# Altium project RX5808_TOP.PrjPcb
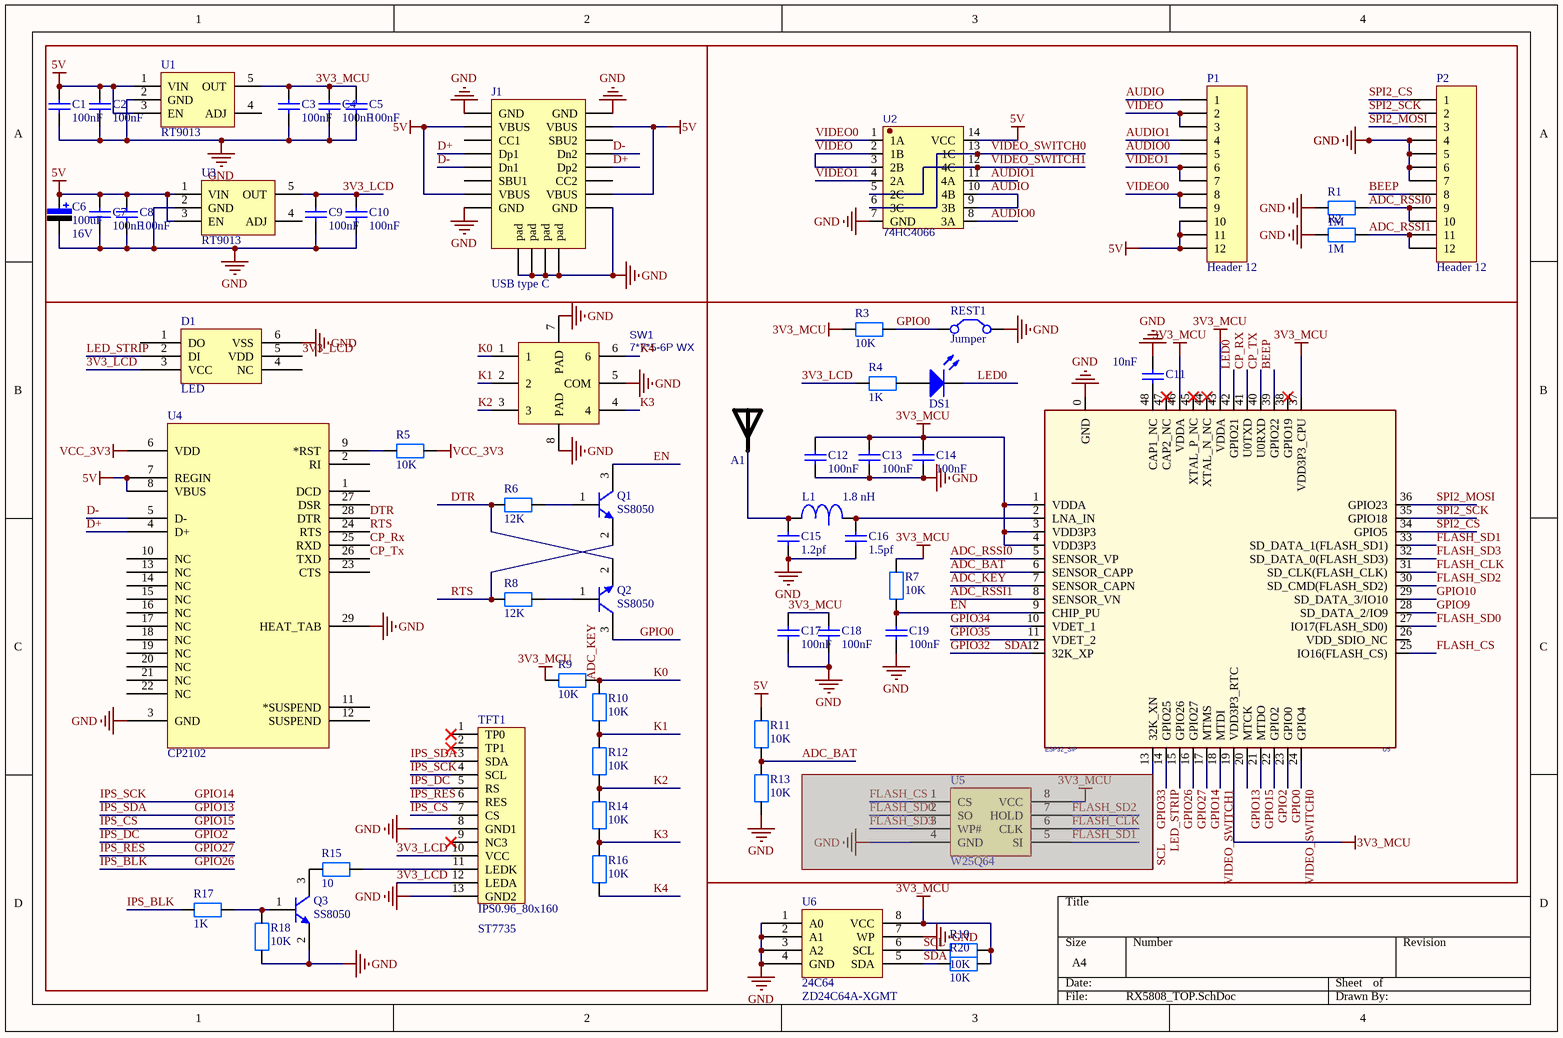
[diagram p0: RX5808_TOP.SchDoc]
1 sheet, 59 parts. Net scope: global (net labels, ports and power ports of the same name join across sheets).
Board file: RX5808_TOP.PcbDoc

## Sheet RX5808_TOP.SchDoc
size A4; SheetNumber: 1; SheetTotal: 1

### Parts
(Parts that share a designator on the sheet are numbered #1, #2 ... from top to bottom, then left to right.)
A1  RAINSUN  [ANT-Rainsun-AN5120]  (value not drawn)
C1  value 100nF  [0603_CAP]  (hidden comment: Cap)
C2  value 100nF  [0603_CAP]  (hidden comment: Cap)
C3  value 100nF  [0603_CAP]  (hidden comment: Cap)
C4  value 100nF  [0603_CAP]  (hidden comment: Cap)
C5  value 100nF  [0603_CAP]  (hidden comment: Cap)
C6  value 100uF  Vol: 16V  [CAP-3216]  (hidden comment: Cap Pol)
C7  value 100nF  [0603_CAP]  (hidden comment: Cap)
C8  value 100nF  [0603_CAP]  (hidden comment: Cap)
C9  value 100nF  [0603_CAP]  (hidden comment: Cap)
C10  value 100nF  [0603_CAP]  (hidden comment: Cap)
C11  value 10nF  [0603_CAP]  (hidden comment: Cap)
C12  value 100nF  [0603_CAP]  (hidden comment: Cap)
C13  value 100nF  [0603_CAP]  (hidden comment: Cap)
C14  value 100nF  [0603_CAP]  (hidden comment: Cap)
C15  value 1.2pf  [0603_CAP]  (hidden comment: Cap)
C16  value 1.5pf  [0603_CAP]  (hidden comment: Cap)
C17  value 100nF  [0603_CAP]  (hidden comment: Cap)
C18  value 100nF  [0603_CAP]  (hidden comment: Cap)
C19  value 100nF  [0603_CAP]  (hidden comment: Cap)
D1  LED  [LED-SMD_6P-L5.0-W5.0-TL]
DS1  LED  [0603_LED]  (value not drawn)
J1  USB type C  [USB Type-C-16Pin_A]
L1  1.8 nH  [L 0603]
P1  Header 12  [HDR1.27-1x12]
P2  Header 12  [HDR1.27-1x12]
Q1  SS8050  [SOT23A]
Q2  SS8050  [SOT23A]
Q3  SS8050  [SOT23A]
R1  1M  [0603_RES]
R2  1M  [0603_RES]
R3  10K  [0603_RES]
R4  1K  [0603_RES]
R5  10K  [0603_RES]
R6  12K  [0603_RES]
R7  10K  [0603_RES]
R8  12K  [0603_RES]
R9  10K  [0603_RES]
R10  10K  [0603_RES]
R11  10K  [0603_RES]
R12  10K  [0603_RES]
R13  10K  [0603_RES]
R14  10K  [0603_RES]
R15  10  [0603_RES]
R16  10K  [0603_RES]
R17  1K  [0603_RES]
R18  10K  [0603_RES]
R19  10K  [0603_RES]
R20  10K  [0603_RES]
REST1  Jumper  [SW-SMD_ST-1195]
SW1  7*7*5-6P WX  [SW-SMD_8P-L7.0-W7.0-P1.40-LS7.4-TL]
TFT1  IPS0.96_80x160  [IPS-0.96]
U1  RT9013  [SOT-23-5_L3.0-W1.7-P0.95-LS2.8-TL]
U2  74HC4066  [TSSOP-14_L5.0-W4.4-P0.65-LS6.4-BL]
U3  RT9013  [SOT-23-5_L3.0-W1.7-P0.95-LS2.8-TL]
U4  CP2102  [QFN-28]
U5#1  ESP32_SIP  [QFN-48_7X7]
U5#2  W25Q64  [SOP-8_width]  (masked out: inside a compile mask, not in the netlist)
U6  24C64  [TSSOP-8_L4.4-W3.0-P0.65-LS6.4-BL-2]

### Nets
3V3_MCU: C3.1 C4.2 C5.2 C12.1 C13.1 C14.1 C17.1 C18.1 R3.2 R7.2 R9.1 R19.1 R20.1 U1.5(OUT) U5#1.1(VDDA) U5#1.3(VDD3P3) U5#1.4(VDD3P3) U5#1.19(VDD3P3_RTC) U5#1.37(VDD3P3_CPU) U5#1.43(VDDA) U5#1.46(VDDA) U6.8(VCC)
5V: C1.2 C2.1 C6.1 C7.2 C8.1 J1.A4(VBUS) J1.A9(VBUS) J1.B4(VBUS) J1.B9(VBUS) P1.10 P1.11 P1.12 R11.2 U1.1(VIN) U1.3(EN) U2.14(VCC) U3.1(VIN) U3.3(EN) U4.7(REGIN) U4.8(VBUS)
GND: C1.1 C2.2 C3.2 C4.1 C5.1 C6.2 C7.1 C8.2 C9.2 C10.2 C11.1 C12.2 C13.2 C14.2 C15.2 C16.2 C17.2 C18.2 C19.2 D1.6(VSS) J1.1(pad) J1.A1(GND) J1.A12(GND) J1.B1(GND) J1.B12(GND) P2.4 P2.5 P2.6 P2.7 Q3.2(E) R1.2 R2.2 R13.1 R18.2 REST1.2(C2) SW1.5(COM) SW1.7(PAD) SW1.8(PAD) TFT1.8(GND1) TFT1.13(GND2) U1.2(GND) U2.7(GND) U3.2(GND) U4.3(GND) U4.29(HEAT_TAB) U5#1.0(GND) U6.1(A0) U6.2(A1) U6.3(A2) U6.4(GND) U6.7(WP)
VCC_3V3: R5.2 U4.6(VDD)
3V3_LCD: C9.1 C10.1 D1.3(VCC) D1.5(VDD) R4.2 TFT1.10(VCC) TFT1.12(LEDA) U3.5(OUT)
ADC_BAT: R11.1 R13.2 U5#1.6(SENSOR_CAPP)
ADC_KEY: R9.2 R10.2 SW1.1 U5#1.7(SENSOR_CAPN)  [also labelled K0]
ADC_RSSI0: P2.9 P2.10 R1.1 U5#1.5(SENSOR_VP)
ADC_RSSI1: P2.11 P2.12 R2.1 U5#1.8(SENSOR_VN)
AUDIO: P1.1 U2.9(3B) U2.10(4B)
AUDIO0: P1.5 U2.8(3A)
AUDIO1: P1.4 U2.11(4A)
BEEP: P2.8 U5#1.39(GPIO22)
CP_RX: U4.25(RXD) U5#1.41(U0TXD)
CP_TX: U4.26(TXD) U5#1.40(U0RXD)
D+: J1.A6(Dp1) J1.B6(Dp2) U4.4(D+)
D-: J1.A7(Dn1) J1.B7(Dn2) U4.5(D-)
DTR: Q2.2(E) R6.1 U4.28(DTR)
EN: C19.1 Q1.3(C) R7.1 U5#1.9(CHIP_PU)
FLASH_CLK: U5#1.31(SD_CLK(FLASH_CLK))
FLASH_CS: U5#1.25(IO16(FLASH_CS))
FLASH_SD0: U5#1.27(IO17(FLASH_SD0))
FLASH_SD1: U5#1.33(SD_DATA_1(FLASH_SD1))
FLASH_SD2: U5#1.30(SD_CMD(FLASH_SD2))
FLASH_SD3: U5#1.32(SD_DATA_0(FLASH_SD3))
GPIO0: Q2.3(C) R3.1 REST1.1(C1) U5#1.23(GPIO0)
GPIO2: TFT1.5(RS) U5#1.22(GPIO2)  [also labelled IPS_DC]
GPIO9: U5#1.28(SD_DATA_2/IO9)
GPIO10: U5#1.29(SD_DATA_3/IO10)
GPIO13: TFT1.3(SDA) U5#1.20(MTCK)  [also labelled IPS_SDA]
GPIO14: TFT1.4(SCL) U5#1.17(MTMS)  [also labelled IPS_SCK]
GPIO15: TFT1.7(CS) U5#1.21(MTDO)  [also labelled IPS_CS]
GPIO26: R17.1 U5#1.15(GPIO26)  [also labelled IPS_BLK]
GPIO27: TFT1.6(RES) U5#1.16(GPIO27)  [also labelled IPS_RES]
GPIO32: R20.2 U5#1.12(32K_XP) U6.5(SDA)  [also labelled SDA]
GPIO34: U5#1.10(VDET_1)
GPIO35: U5#1.11(VDET_2)
K1: R10.1 R12.2 SW1.2
K2: R12.1 R14.2 SW1.3
K3: R14.1 R16.2 SW1.4
K4: R16.1 SW1.6
LED0: DS1.2(K) U5#1.42(GPIO21)
LED_STRIP: D1.2(DI) U5#1.14(GPIO25)
RTS: Q1.2(E) R8.1 U4.24(RTS)
SCL: R19.2 U6.6(SCL)
SPI2_CS: P2.1 U5#1.34(GPIO5)
SPI2_MOSI: P2.3 U5#1.36(GPIO23)
SPI2_SCK: P2.2 U5#1.35(GPIO18)
VIDEO: P1.2 P1.3 U2.2(1B) U2.3(2B)
VIDEO0: P1.8 P1.9 U2.1(1A)
VIDEO1: P1.6 P1.7 U2.4(2A)
VIDEO_SWITCH0: U2.6(3C) U2.13(1C) U5#1.24(GPIO4)
VIDEO_SWITCH1: U2.5(2C) U2.12(4C) U5#1.18(MTDI)
NetA1_1: A1.1 C15.1 L1.1
NetC11_2: C11.2 U5#1.48(CAP1_NC)
NetC16_1: C16.1 L1.2 U5#1.2(LNA_IN)
NetDS1_1: DS1.1(A) R4.1
NetQ1_1: Q1.1(B) R6.2
NetQ2_1: Q2.1(B) R8.2
NetQ3_1: Q3.1(B) R17.2 R18.1
NetQ3_3: Q3.3(C) R15.1
NetR5_1: R5.1 U4.9(*RST)
NetR15_2: R15.2 TFT1.11(LEDK)

Not connected (* = marked no-connect by the designer): D1 1(DO) 4(NC); J1 A5(CC1) A8(SBU1) B5(CC2) B8(SBU2); TFT1 1(TP0)* 2(TP1)* 9(NC3)*; U1 4(ADJ); U3 4(ADJ); U4 1(DCD) 2(RI) 10(NC) 11(*SUSPEND) 12(SUSPEND) 13(NC) 14(NC) 15(NC) 16(NC) 17(NC) 18(NC) 19(NC) 20(NC) 21(NC) 22(NC) 23(CTS) 27(DSR); U5#1 13(32K_XN) 26(VDD_SDIO_NC) 38(GPIO19)* 44(XTAL_N_NC)* 45(XTAL_P_NC)* 47(CAP2_NC)*

### Notes on the sheet
- (near TFT1) ST7735
- (near U6) ZD24C64A-XGMT

### Library data of the parts
A1 = ANT-Rainsun-AP5120
C1-C5 C7-C19 = Cap: 无极性电容; Published: 8-Jun-2000; LatestRevisionDate: 17-Jul-2002; LatestRevisionNote: Re-released for DXP Platform.; PackageReference: RAD-0.3; Publisher: Altium Limited
C6 = Cap Pol: 极性电解电容; Published: 8-Jun-2000; LatestRevisionDate: 17-Jul-2002; LatestRevisionNote: Re-released for DXP Platform.; PackageReference: RB7.6-15; Publisher: Altium Limited
D1 = WS2812
J1 = Type-C: TYPEC接口-16PIN
L1 = Inductance: 电感
P1 P2 = Header 12: Header, 12-Pin; LatestRevisionDate: 17-Jul-2002; LatestRevisionNote: Re-released for DXP Platform.; Publisher: Altium Limited
Q1-Q3 = SS8050: NPN三极管
R1-R20 = RES: 电阻
REST1 = Jumper: 按键; Published: 24-Mar-1999; LatestRevisionDate: 17-Jul-2002; LatestRevisionNote: Re-released for DXP Platform.; PackageReference: RAD-0.2; Publisher: Altium Limited
SW1 = 7*7*5-6P WX: 五向按键; BOM_Manufacturer: SHOU HAN(首韩); Contributor: LCSC; BOM_Supplier: LCSC; BOM_Supplier Part: C2858286; BOM_Manufacturer Part: 7*7*5-6P WX; BOM_JLCPCB Part Class: Extended Part; spicePre: S; spiceSymbolName: 7*7*5-6P WX
TFT1 = IPS0.96_80x160: IPS-135x240; BOM名称: 1.44寸TFT屏; 版权归属: 源创客; 学习资源: www.ooocke.com
U1 U3 = SPX5205: LDO稳压
U2 = SN74HC4066DBR: BOM_Manufacturer: TI; spicePre: X; BOM_Supplier: LCSC; BOM_Manufacturer Part: SN74HC4066DBR; BOM_Supplier Part: C6849; BOM_JLCPCB Part Class: Extended Part; spiceSymbolName: SN74HC4066DBR
U4 = CP2102: USB转TTL; PART DESC: SINGLE-CHIP USB TO UART BRIDGE, QFN28, RoHS.; MFG #1: SILICON LABS; PART NUMBER: CP2102; Value: Value; RefDes: RefDes; Type: DEV
U5#1 = ESP32-PICO
U5#2 = W25Q64: FLASH
U6 = 24C02: E2PROM